# Altium schematic sheet Block_Diagram.SchDoc
size A3; SheetNumber: 1; SheetTotal: 5
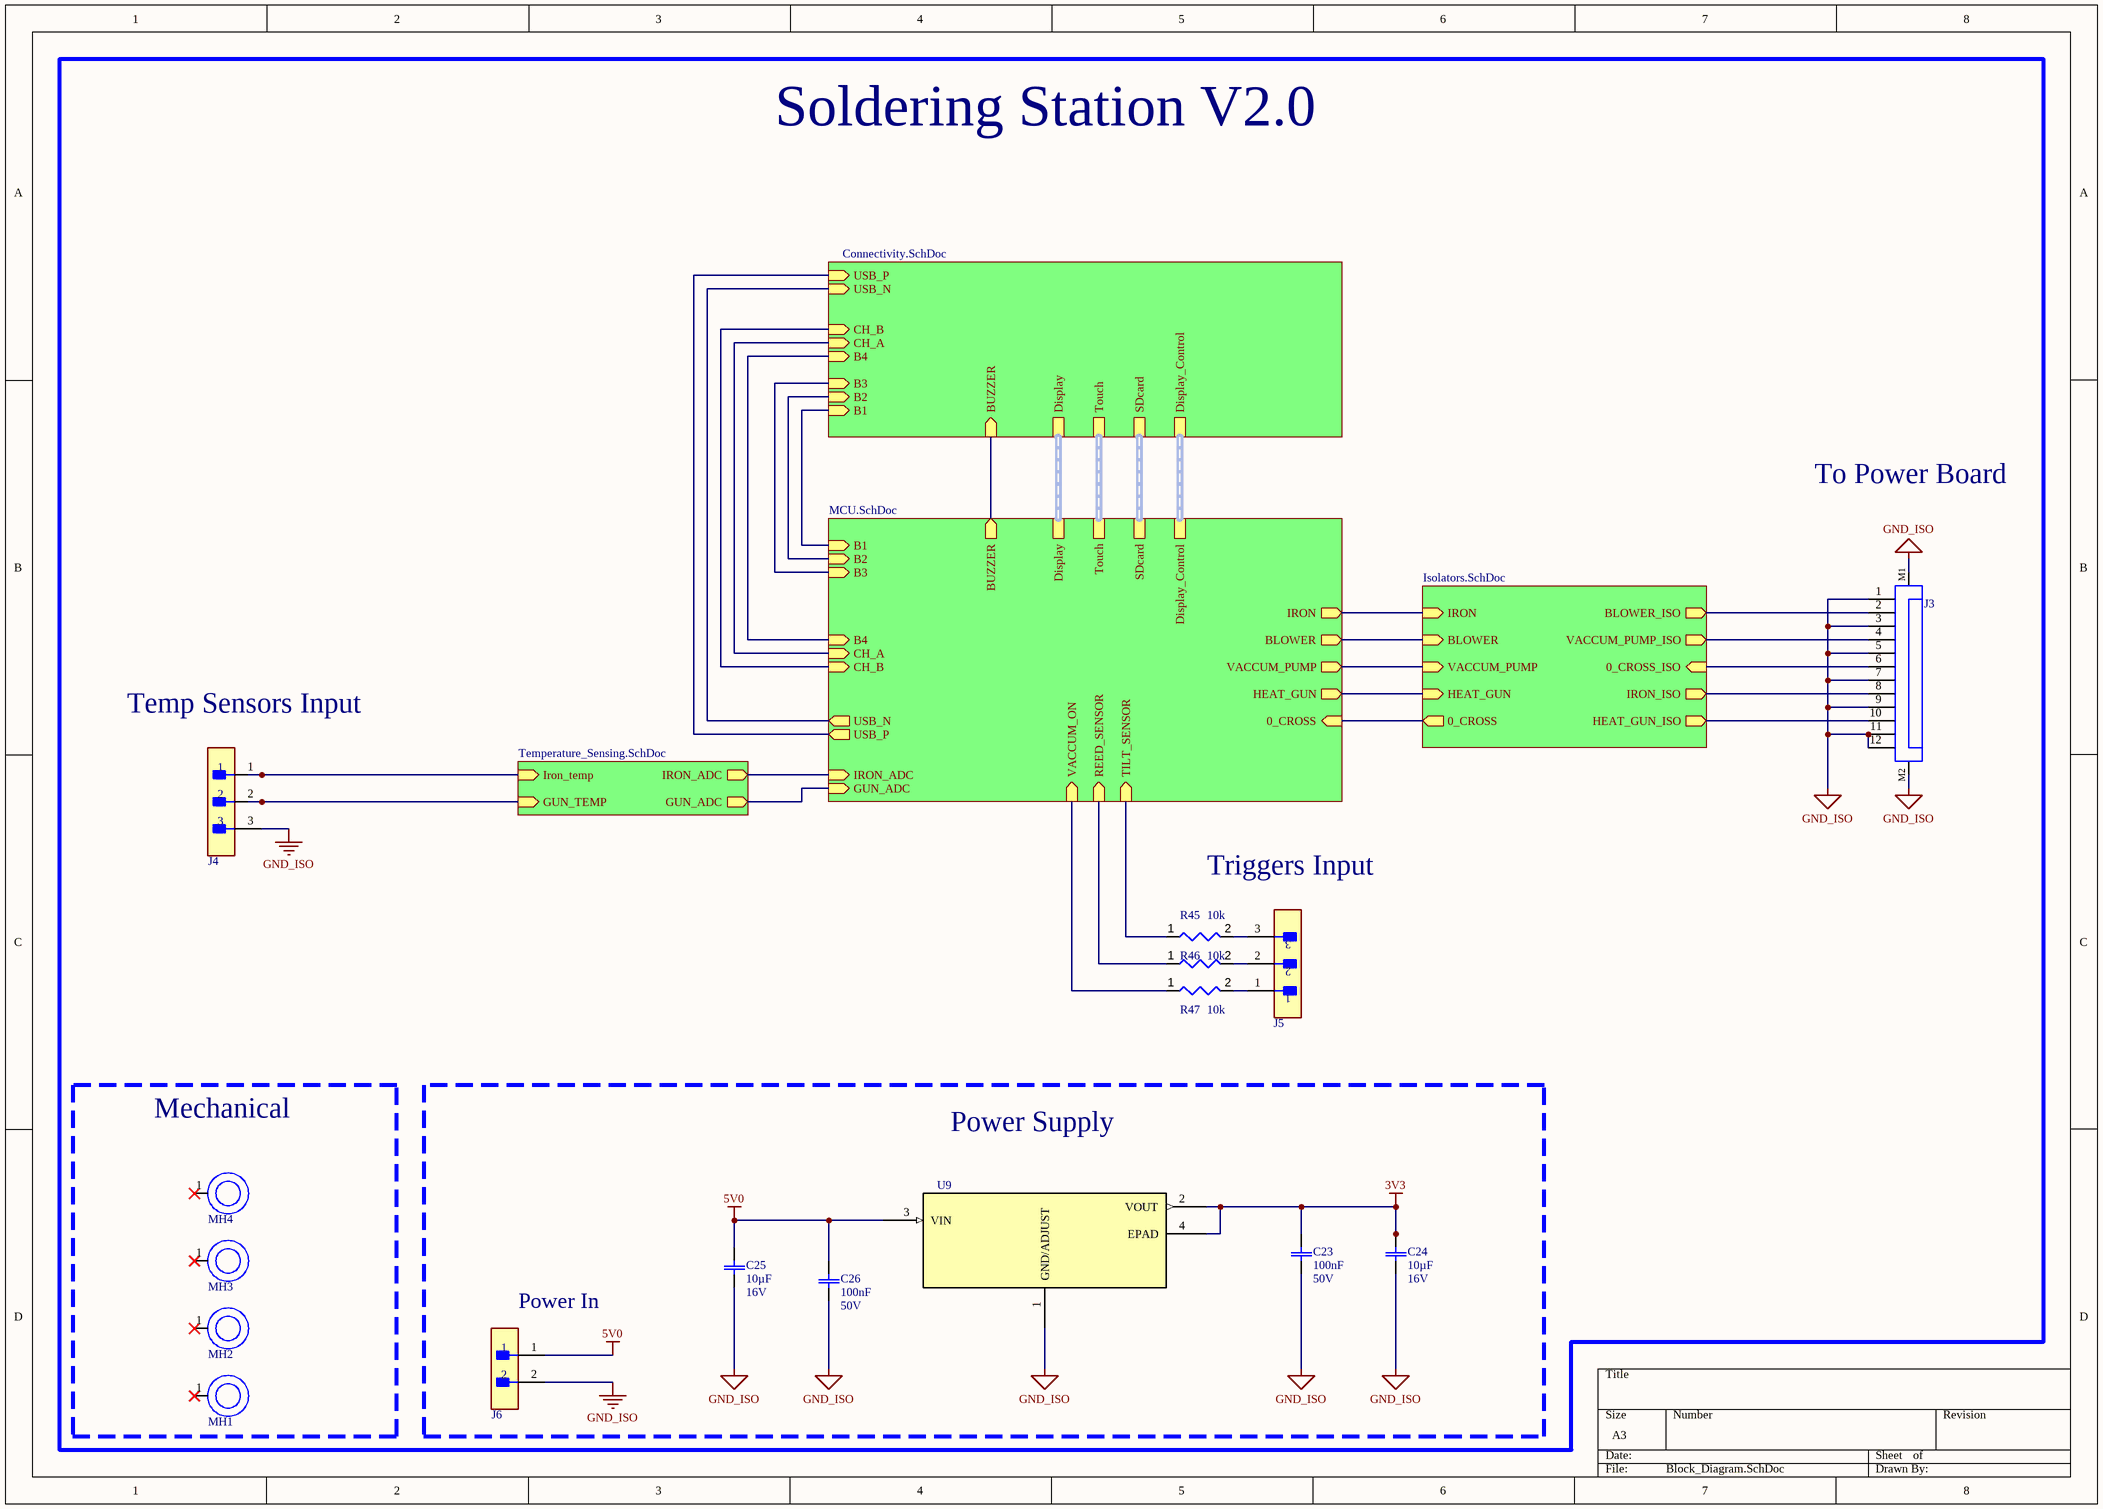
[diagram p0: Block_Diagram.SchDoc]

## Parts
C23  value 100nF  Voltage Rating: 50V  [Generic Ceramic 0603 CAP]  (hidden comment: CAP-MLCC_SMD-0603_MR-GCM_u_0.1uF_50V_10%_X8L)
C24  value 10µF  Voltage Rating: 16V  [Generic Ceramic 0805 CAP]  (hidden comment: CAP-MLCC_SMD-0805_TDK-CGA_u_10uF_16V_20%_X7S)
C25  value 10µF  Voltage Rating: 16V  [Generic Ceramic 0805 CAP]  (hidden comment: CAP-MLCC_SMD-0805_TDK-CGA_u_10uF_16V_20%_X7S)
C26  value 100nF  Voltage Rating: 50V  [Generic Ceramic 0603 CAP]  (hidden comment: CAP-MLCC_SMD-0603_MR-GCM_u_0.1uF_50V_10%_X8L)
J3  687112183622  [687112183622]  (value not drawn)
J4  B3P-SHF-1AA(LF)(SN)  [FP-B3P-SHF-1AA_LF_SN-MFG]  (value not drawn)
J5  B3P-SHF-1AA(LF)(SN)  [FP-B3P-SHF-1AA_LF_SN-MFG]  (value not drawn)
J6  B2B-XH-A(LF)(SN)  [FP-B2B-XH-A_LF_SN-MFG]  (value not drawn)
MH1  3mm_Mounting_Hole  [Single_3mm_Mounting_Hole]  (value not drawn)
MH2  3mm_Mounting_Hole  [Single_3mm_Mounting_Hole]  (value not drawn)
MH3  3mm_Mounting_Hole  [Single_3mm_Mounting_Hole]  (value not drawn)
MH4  3mm_Mounting_Hole  [Single_3mm_Mounting_Hole]  (value not drawn)
R45  value 10k  [Generic_0603_RES]  (hidden comment: RES-TK_SMD-0603_VIS-CRCW_K_10K_1/10W_1%)
R46  value 10k  [Generic_0603_RES]  (hidden comment: RES-TK_SMD-0603_VIS-CRCW_K_10K_1/10W_1%)
R47  value 10k  [Generic_0603_RES]  (hidden comment: RES-TK_SMD-0603_VIS-CRCW_K_10K_1/10W_1%)
U9  AMS1117-3.3  [AMS1117-3.3-Footprint-1]  (value not drawn)

## Blocks framed on the sheet
Mechanical: MH1-MH4
Power Supply: C23-C26 J6 U9

## Sub-sheets
Designator = MCU.SchDoc: Display (harness SPI), Touch (harness SPI), SDcard (harness SPI), Display_Control (harness Display_Control), B1 (in), B2 (in), B3 (in), B4 (in), CH_A (in), CH_B (in), TILT_SENSOR (in), REED_SENSOR (in), VACCUM_ON (in), IRON_ADC (in), GUN_ADC (in), IRON (out), BLOWER (out), VACCUM_PUMP (out), HEAT_GUN (out), USB_N (out), USB_P (out), BUZZER (out), 0_CROSS (in)
Designator = Temperature_Sensing.SchDoc: Iron_temp (in), IRON_ADC (out), GUN_TEMP (in), GUN_ADC (out)
Designator = Isolators.SchDoc: IRON (in), BLOWER (in), VACCUM_PUMP (in), HEAT_GUN (in), 0_CROSS (out), 0_CROSS_ISO (in), IRON_ISO (out), BLOWER_ISO (out), VACCUM_PUMP_ISO (out), HEAT_GUN_ISO (out)
Designator = Connectivity.SchDoc: Display (harness SPI), Touch (harness SPI), SDcard (harness SPI), Display_Control (harness Display_Control), B1 (in), B2 (in), B3 (in), B4 (in), CH_A (in), CH_B (in), USB_N (in), USB_P (in), BUZZER (in)

## Nets
3V3: C23.2 C24.2 U9.2(VOUT) U9.4(EPAD)
5V0: C25.2 C26.2 J6.1 U9.3(VIN)
GND_ISO: C23.1 C24.1 C25.1 C26.1 J3.1 J3.3 J3.5 J3.7 J3.9 J3.11 J3.12 J3.M1 J3.M2 J4.3 J6.2 U9.1(GND/ADJUST)
NetJ3_2: J3.2 ; sheet Designator/BLOWER_ISO
NetJ3_4: J3.4 ; sheet Designator/VACCUM_PUMP_ISO
NetJ3_6: J3.6 ; sheet Designator/0_CROSS_ISO
NetJ3_8: J3.8 ; sheet Designator/IRON_ISO
NetJ3_10: J3.10 ; sheet Designator/HEAT_GUN_ISO
NetJ4_1: J4.1 ; sheet Designator/Iron_temp
NetJ4_2: J4.2 ; sheet Designator/GUN_TEMP
NetJ5_1: J5.1 R47.2
NetJ5_2: J5.2 R46.2
NetJ5_3: J5.3 R45.2
NetR45_1: R45.1 ; sheet Designator/TILT_SENSOR
NetR46_1: R46.1 ; sheet Designator/REED_SENSOR
NetR47_1: R47.1 ; sheet Designator/VACCUM_ON
(unnamed): sheet Designator/B1, sheet Designator/B1
(unnamed): sheet Designator/B2, sheet Designator/B2
(unnamed): sheet Designator/B3, sheet Designator/B3
(unnamed): sheet Designator/B4, sheet Designator/B4
(unnamed): sheet Designator/CH_A, sheet Designator/CH_A
(unnamed): sheet Designator/CH_B, sheet Designator/CH_B
(unnamed): sheet Designator/IRON_ADC, sheet Designator/IRON_ADC
(unnamed): sheet Designator/GUN_ADC, sheet Designator/GUN_ADC
(unnamed): sheet Designator/IRON, sheet Designator/IRON
(unnamed): sheet Designator/BLOWER, sheet Designator/BLOWER
(unnamed): sheet Designator/VACCUM_PUMP, sheet Designator/VACCUM_PUMP
(unnamed): sheet Designator/HEAT_GUN, sheet Designator/HEAT_GUN
(unnamed): sheet Designator/USB_N, sheet Designator/USB_N
(unnamed): sheet Designator/USB_P, sheet Designator/USB_P
(unnamed): sheet Designator/BUZZER, sheet Designator/BUZZER
(unnamed): sheet Designator/0_CROSS, sheet Designator/0_CROSS

Not connected (* = marked no-connect by the designer): MH1 1*; MH2 1*; MH3 1*; MH4 1*

## Notes on the sheet
- Soldering Station V2.0
- To Power Board
- Temp Sensors Input
- Triggers Input
- (near J6) Power In

## Library data of the parts
C23 C26 = CMP-001-00115-11: Ceramic Capacitor, Multilayer, Ceramic, 50V, 10% +Tol, 10% -Tol, X8L, -40/+15% TC, 0.1uF, Surface Mount, 0603; Automotive: AEQ-200; Min Operating Temperature: -55°C; Case/Package: 0603; Mounting Technology: Surface Mount; RoHS Compliant: Yes; Capacitor Type: Ceramic; Pins: 2; Max Operating Temperature: 150°C
C24 C25 = CMP-001-00173-2: Ceramic Capacitor, Multilayer, Ceramic, 16V, 20% +Tol, 20% -Tol, X7S, 22% TC, 10uF, Surface Mount, 0805; RoHS Compliant: Yes; Capacitor Type: Ceramic; Tolerance: 20%; Pins: 2; Mounting Technology: SMD; Case/Package: 0805; Automotive: AEQ-Q200; Dielectric: X7S
J3 = CMP-1502-01592-2: NexarPartId: 81848331; Gender: Receptacle; Contact Resistance: 30mΩ; Pitch: 500µm; Current Rating: 400mA; Insulation Resistance: 100MΩ; Operating Supply Voltage: 50V; Min Operating Temperature: -25°C; Packaging: Tape and Reel; Orientation: Horizontal; Number of Pins: 12; Length: 6.6mm; Max Operating Temperature: 85°C; Lead Pitch: 500µm; RoHS: Compliant
J4 J5 = CMP-17439-000681-1: CONN HEADER VERT 3POS 2.5MM; Mated Stacking Heights: 14.9mm; Current Rating: 3A; Pitch: 0.098inch; Number of Positions: 3; Voltage Rating: 250V; Contact Mating Length: 0.236inch; Orientation: Straight; Number of Rows: 1; Series: NH; Color: Natural; Mount: Through Hole; Flammability Rating: UL94 V-0; Contact Type: Male Pin; Contact Finish - Mating: TIN; Contact Shape: Square; Contact Material: Brass; Termination: Solder; Lead Free: Lead Free; Fastening Type: Friction; Packaging: Bulk; Contact Plating: Tin; Insulation Color: Natural; Number of Contacts: 3; Connector Type: Header; Insulation Material: Nylon
J6 = CMP-001-0161-1: CONNECTOR HEADER, XH SERIES, 2 POSITION, 2.50MM, Press-Fit Solder, Detent Lock, Natural; Current Rating: 3A; Connector Type: Male Pin; Voltage Rating (AC): 250V; Wire/Cable Gauge: 22AWG; Number of Contacts: 2; Pitch: 2.5mm; Contact Resistance: 20mΩ; Insulation Resistance: 1GΩ; Fastening Type: Detent; REACH SVHC: Yes; Orientation: Straight; Depth: 5.75mm; Width: 6.35mm; Max Operating Temperature: 85°C; Mounting Technology: Through Hole; China RoHS: Compliant; Lead Pitch: 2.5mm; Contact Gender: Male; Contact Material: Copper, Tin; Terminal Pitch: 2.5mm; Termination: Solder; Max Voltage Rating (AC): 250V; Lead Free: Lead Free; Pins: 2; Color: Natural; Lifecycle Status: Production; Max Current Rating: 3A; Height: 7mm; Min Operating Temperature: -25°C; Weight: 28.349523g; Housing Color: White; Number of Rows: 1; Length: 7.4mm; Housing Material: Polyamide; Voltage Rating: 250V; Max Voltage Rating (DC): 250V; Number of Positions: 2; Contact Plating: Tin; RoHS: Compliant
MH1-MH4 = CMP-001-0046-3: 3.2mm, sPad Mounting Hole; Size: 3mm
R45-R47 = CMP-009-00246-1: Fixed Resistor, Metal Glaze/thick Film, 0.1W, 10000ohm, 75V, 1% +/-Tol, 100ppm/Cel, Surface Mount, 0603; Power: 100mW; Mounting Technology: Surface Mount; Pins: 2; Min Operating Temperature: -55°C; Tolerance: 1%; RoHS Compliant: Yes; Max Operating Temperature: 155°C; Case/Package: 0603; Voltage Rating: 75V
U9 = CMP-001-0171-3: Gull Wing EAR99 Fixed Positive Single Output Ldo Regulator Dual Voltage Regulator Linear 125C 1.2W 1A 1.8MM; Dropout Voltage: 1.1V; Output Voltage: 3.3V; Max Supply Voltage: 15V; Nominal Supply Current: 5mA; Number of Outputs: 1; Max Junction Temperature (Tj): 125°C; Height: 1.8mm; Output Current: 1A; Min Operating Temperature: -40°C; Pins: 2; Max Power Dissipation: 1.2W; Max Operating Temperature: 125°C; RoHS: Compliant; Case/Package: SOT-223